# EAGLE design Grove - Triple Color E-Ink Display 2.13'' (EAGLE 9.1.2)

## Sheet 1 of 2
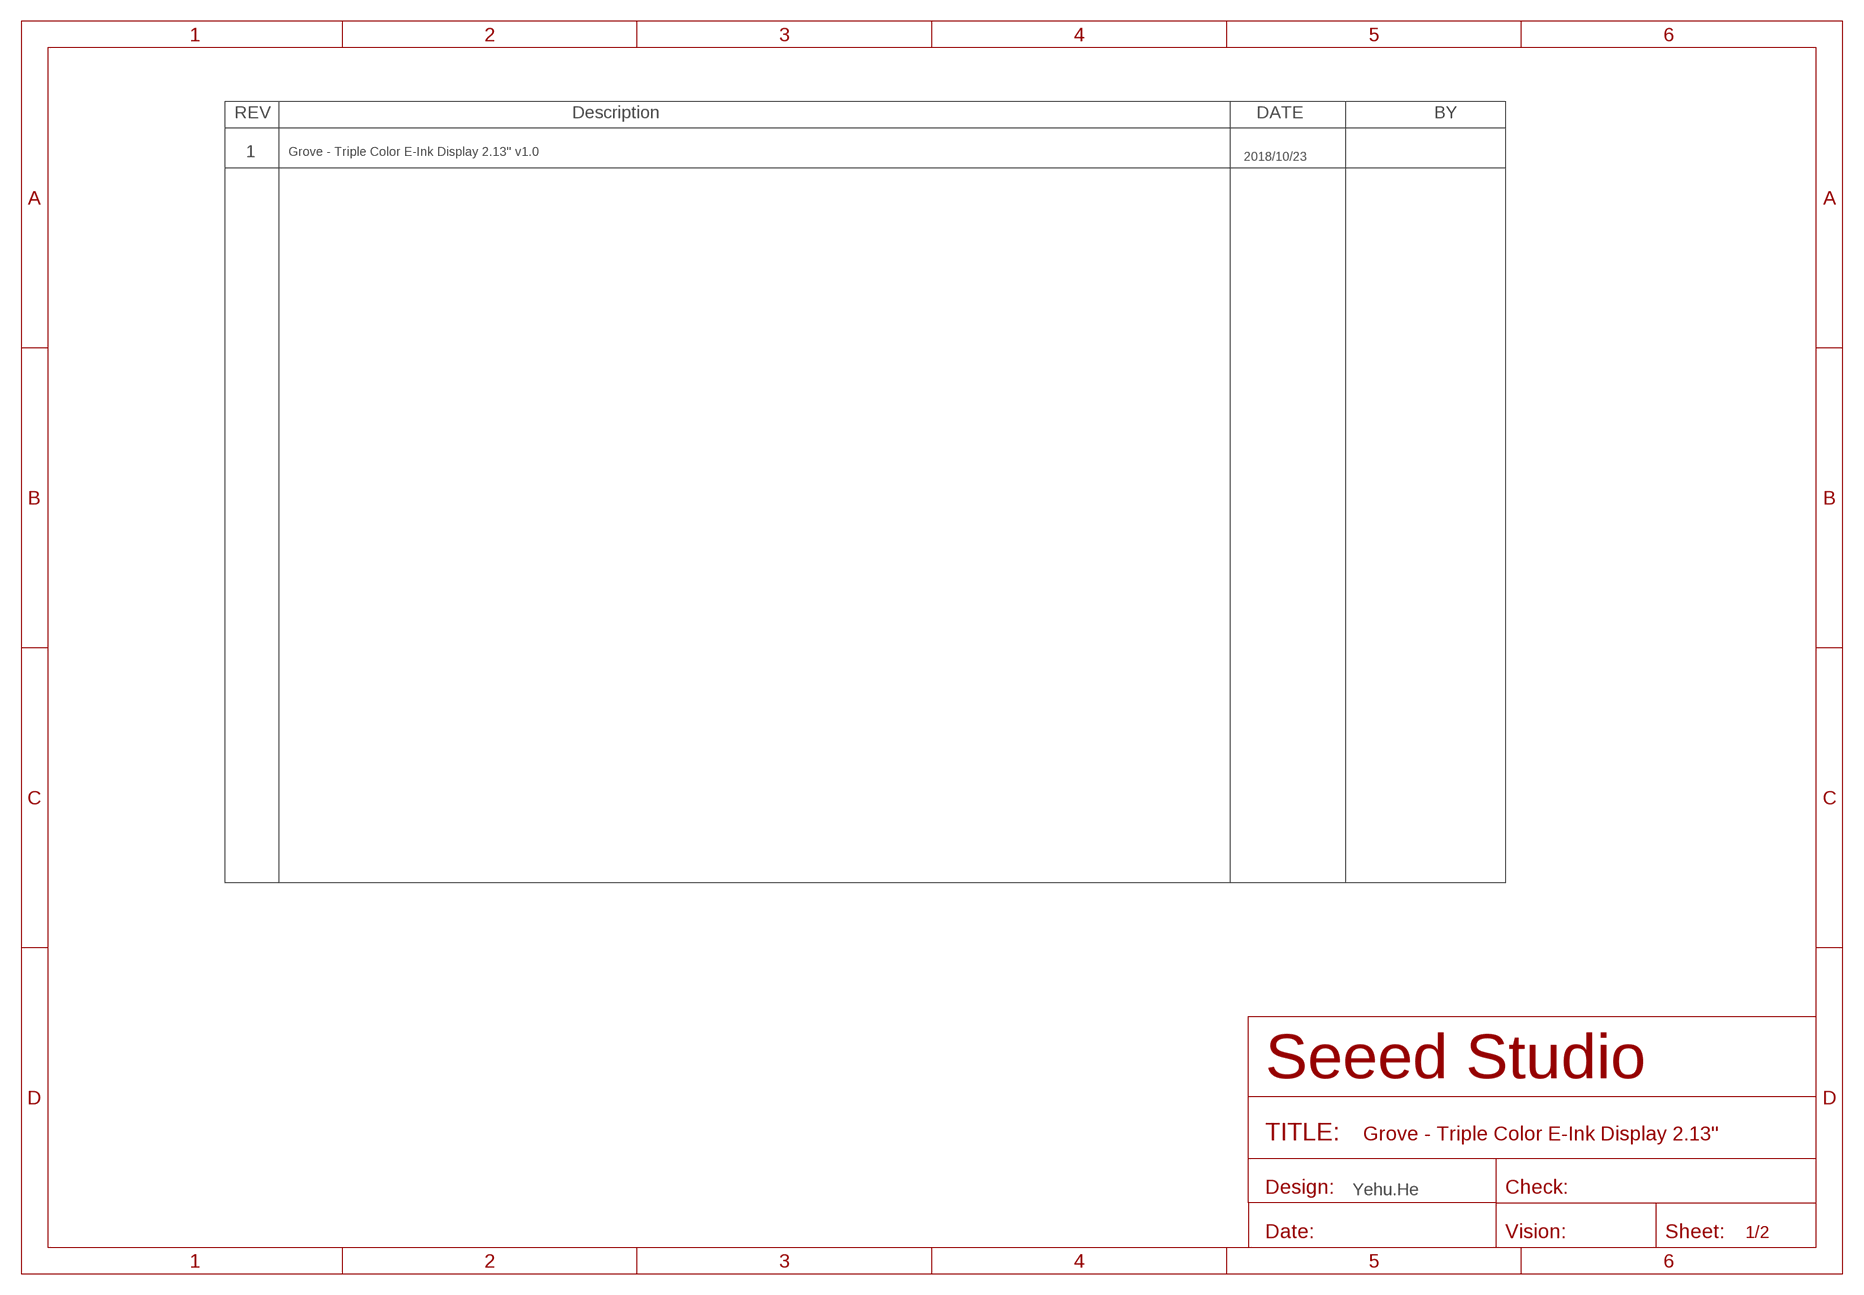
[diagram p0: schematic, sheet 1]

### Notes on the sheet
- 1 | Grove - Triple Color E-Ink Display 2.13'' v1.0
- 2018/10/23
- Yehu.He

## Sheet 2 of 2
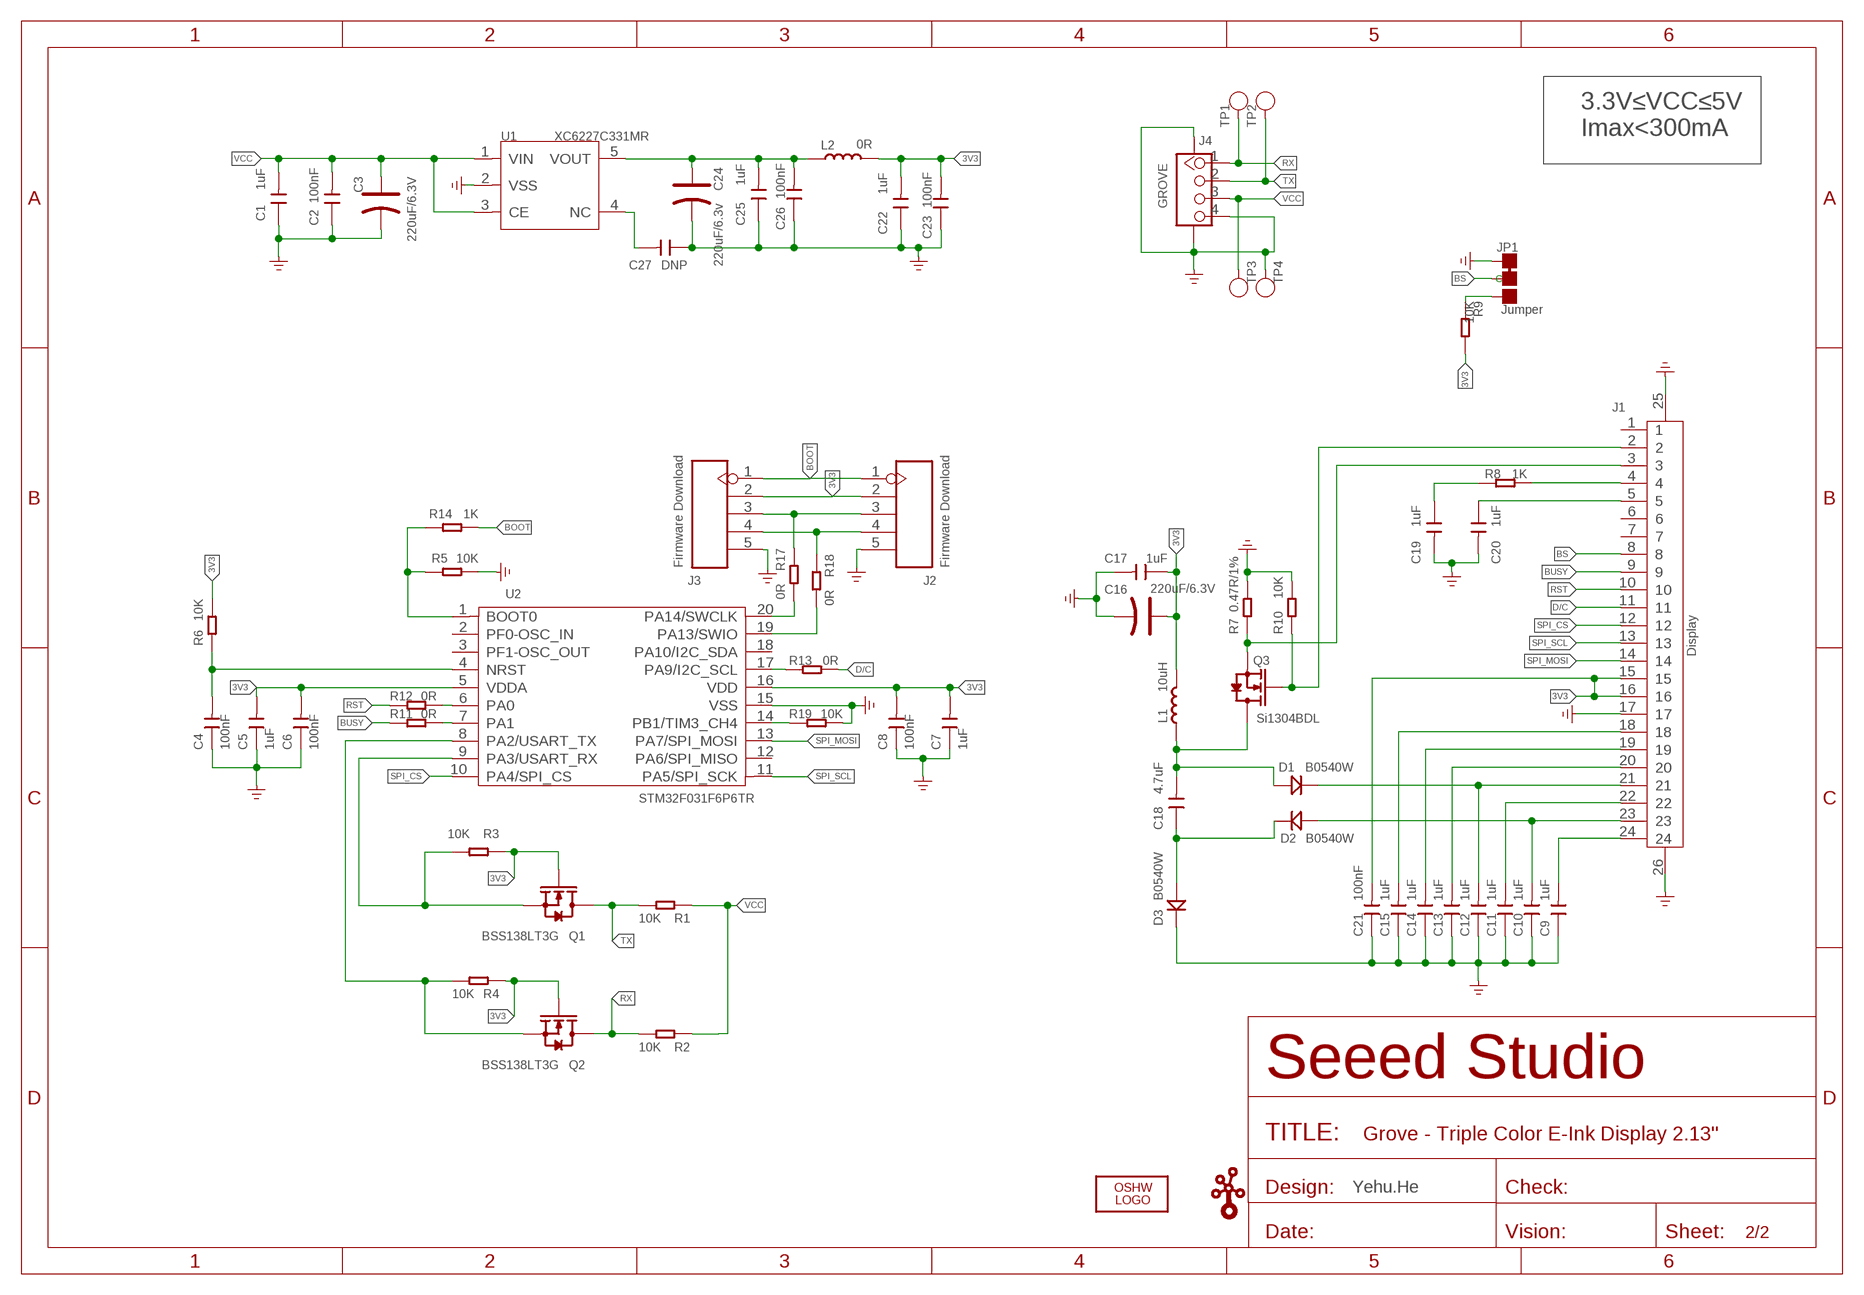
[diagram p1: schematic, sheet 2]

### Parts
C1  1uF  CAP-0603  [C0603]
C2  100nF  CAP-0603  [C0603]
C3  220uF/6.3V  CAP-POLAR-AVX-B  [AVX-B]
C4  100nF  CAP-0603  [C0603]
C5  1uF  CAP-0603  [C0603]
C6  100nF  CAP-0603  [C0603]
C7  1uF  CAP-0603  [C0603]
C8  100nF  CAP-0603  [C0603]
C9  1uF  CAP-0603  [C0603]
C10  1uF  CAP-0603  [C0603]
C11  1uF  CAP-0603  [C0603]
C12  1uF  CAP-0603  [C0603]
C13  1uF  CAP-0603  [C0603]
C14  1uF  CAP-0603  [C0603]
C15  1uF  CAP-0603  [C0603]
C16  220uF/6.3V  CAP-POLAR-AVX-B  [AVX-B]
C17  1uF  CAP-0603  [C0603]
C18  4.7uF  CAP-0805  [C0805]
C19  1uF  CAP-0603  [C0603]
C20  1uF  CAP-0603  [C0603]
C21  100nF  CAP-0603  [C0603]
C22  1uF  CAP-0805  [C0805]
C23  100nF  CAP-0603  [C0603]
C24  220uF/6.3v  CAP-POLAR-AVX-B  [AVX-B]
C25  1uF  CAP-0805  [C0805]
C26  100nF  CAP-0603  [C0603]
C27  DNP  CAP-0603  [C0603]
D1  B0540W  DIODE'0805'  [SOD-323]
D2  B0540W  DIODE'0805'  [SOD-323]
D3  B0540W  DIODE'0805'  [SOD-323]
J1  Display  FPC-CONNECTOR-24P  [FPCB24-SMD-0.5-17.6X5.0X2MM]
J2  Firmware Download  HEADER-5P-SMD2.54  [H5-SMD-2.54]
J3  Firmware Download  HEADER-5P-SMD2.54  [H5-SMD-2.54]
J4  GROVE  GROVE-CONNECTOR-SMD'90D'  [HW4-SMD-2.0-90D]
JP1  Jumper  JP-3P-SHORT  [3P-SMD-SHORT]
L1  10uH  INDUCTOR/FERRITE-BEAD5040S  [L5040S]
L2  0R  INDUCTOR/FERRITE-BEAD'0805'  [L0805]
LOGO2  LOGO-OSHW-FILLX0200-NT  [OSHW_FILLX200_NOTEXT]
Q1  BSS138LT3G  MOSFET-N'SI1304BDL'  [SOT-323]
Q2  BSS138LT3G  MOSFET-N'SI1304BDL'  [SOT-323]
Q3  Si1304BDL  MOSFET-N'SI1304BDL'  [SOT-323]
R1  10K  RES-0603  [R0603]
R2  10K  RES-0603  [R0603]
R3  10K  RES-0603  [R0603]
R4  10K  RES-0603  [R0603]
R5  10K  RES-0603  [R0603]
R6  10K  RES-0603  [R0603]
R7  0.47R/1%  RES-0603  [R0603]
R8  1K  RES-0603  [R0603]
R9  10K  RES-0603  [R0603]
R10  10K  RES-0603  [R0603]
R11  0R  RES-0603  [R0603]
R12  0R  RES-0603  [R0603]
R13  0R  RES-0603  [R0603]
R14  1K  RES-0603  [R0603]
R17  0R  RES-0603  [R0603]
R18  0R  RES-0603  [R0603]
R19  10K  RES-0603  [R0603]
TP1  Test  TEST-POINT'4545'  [TP-D45MIL]
TP2  Test  TEST-POINT'4545'  [TP-D45MIL]
TP3  Test  TEST-POINT'4545'  [TP-D45MIL]
TP4  Test  TEST-POINT'4545'  [TP-D45MIL]
U1  XC6227C331MR  PMIC-LDO-XC6210  [SOT-23-5]
U2  STM32F031F6P6TR  MCU-STM32F030  [TSSOP20-0.65-6.5X4.4MM]
U$20  LOGO-GROVE  [GROVE-SILK-BIG]

### Nets
3V3: C5.2 C6.2 C7.2 C8.2 C16.+ C17.1 C21.2 C22.2 C23.2 J1.15 J1.16 J2.2 J3.2 L1.2 L2.2 Q1.1(G) Q2.1(G) R3.2 R4.2 R6.1 R9.2 U2.5(VDDA) U2.16(VDD)
BOOT: J2.1 J3.1 R14.1
BS: J1.8 JP1.MM(C)
BUSY: J1.9 R11.1
D/C: J1.11 R13.1
GDR: J1.2 Q3.1(G) R10.1
GND: C1.1 C2.1 C3.- C4.1 C5.1 C6.1 C7.1 C8.1 C9.1 C10.1 C11.1 C12.1 C13.1 C14.1 C15.1 C16.- C17.2 C19.2 C20.2 C21.1 C22.1 C23.1 C24.- C25.1 C26.1 C27.1 D3.- J1.17 J1.25(P1) J1.26(P2) J2.5 J3.5 J4.4 J4.SS1 J4.SS2 JP1.11(L) R5.1 R7.2 R10.2 R19.1 TP4.T U1.2(VSS) U2.15(VSS) ; supply symbol labelled GND_POWER
N$1: R11.2 U2.7(PA1)
N$2: R12.2 U2.6(PA0)
N$3: R13.2 U2.17(PA9/I2C_SCL)
N$4: J2.3 J3.3 R17.1
N$5: R5.2 R14.2 U2.1(BOOT0)
N$6: R19.2 U2.14(PB1/TIM3_CH4)
N$7: C27.2 U1.4(NC)
N$8: C4.2 R6.2 U2.4(NRST)
N$9: C18.1 D2.- D3.+
N$10: J2.4 J3.4 R18.1
N$11: C18.2 D1.+ L1.1 Q3.3(D)
N$12: C19.1 R8.2
N$13: R17.2 U2.20(PA14/SWCLK)
N$14: R18.2 U2.19(PA13/SWIO)
N$22: C15.2 J1.18
N$23: C14.2 J1.19
N$24: C13.2 J1.20
N$25: C12.2 D1.- J1.21
N$26: C11.2 J1.22
N$27: C10.2 D2.+ J1.23
N$28: JP1.00(R) R9.1
RESE: J1.3 Q3.2(S) R7.1
RST: J1.10 R12.1
RX: J4.1 Q2.3(D) R2.1 TP1.T
SCL_3V3: Q1.2(S) R3.1 U2.9(PA3/USART_RX)
SDA_3V3: Q2.2(S) R4.1 U2.8(PA2/USART_TX)
SPI_CS: J1.12 U2.10(PA4/SPI_CS)
SPI_MOSI: J1.14 U2.13(PA7/SPI_MOSI)
SPI_SCL: J1.13 U2.11(PA5/SPI_SCK)
TX: J4.2 Q1.3(D) R1.1 TP2.T
VCC: C1.2 C2.2 C3.+ J4.3 R1.2 R2.2 TP3.T U1.1(VIN) U1.3(CE)
VCOM: C9.2 J1.24
VGH: C20.1 J1.5
VGL: J1.4 R8.1
VOUT: C24.+ C25.2 C26.2 L2.1 U1.5(VOUT)
Unconnected: J1.1 J1.6 J1.7 U2.2(PF0-OSC_IN) U2.3(PF1-OSC_OUT) U2.12(PA6/SPI_MISO) U2.18(PA10/I2C_SDA)

### Notes on the sheet
- 3.3V≤VCC≤5V
  Imax<300mA
- Yehu.He

## Library data of the parts
C1 C2 C4-C15 C17-C23 C25-C27 = Discrete-new:CAP: Ceramic Capacitors
C3 C16 C24 = Discrete-new:CAP-POLAR: Electrolytic Capacitors,Tantalum Capacitors and Super Capacitors
D1-D3 = Discrete-new:DIODE*
J1 = Connector-new:FPC-CONNECTOR-24P
J2 J3 = Connector-new:HEADER-5P
J4 = Connector-new:GROVE-CONNECTOR-SMD: 4P-SMD-2.0:320110030;4P-SMD-2.0-90D:320110032
JP1 = Discrete-new:JP-3P-SHORT
L1 L2 = Discrete-new:INDUCTOR/FERRITE-BEAD
LOGO2 = logo:LOGO-OSHW-FILL; PARTNO: DNP
Q1-Q3 = Discrete-new:MOSFET-N: IRLL014: http://www.vishay.com/docs/91319/sihll014.pdf
R1-R14 R17-R19 = Discrete-new:RES
TP1-TP4 = Discrete-new:TEST-POINT; PARTNO: DNP
U1 = IC-new:PMIC-LDO-XC6210
U2 = IC-new:MCU-STM32F030
U$20 = logo:LOGO-GROVE; PARTNO: DNP

## Board
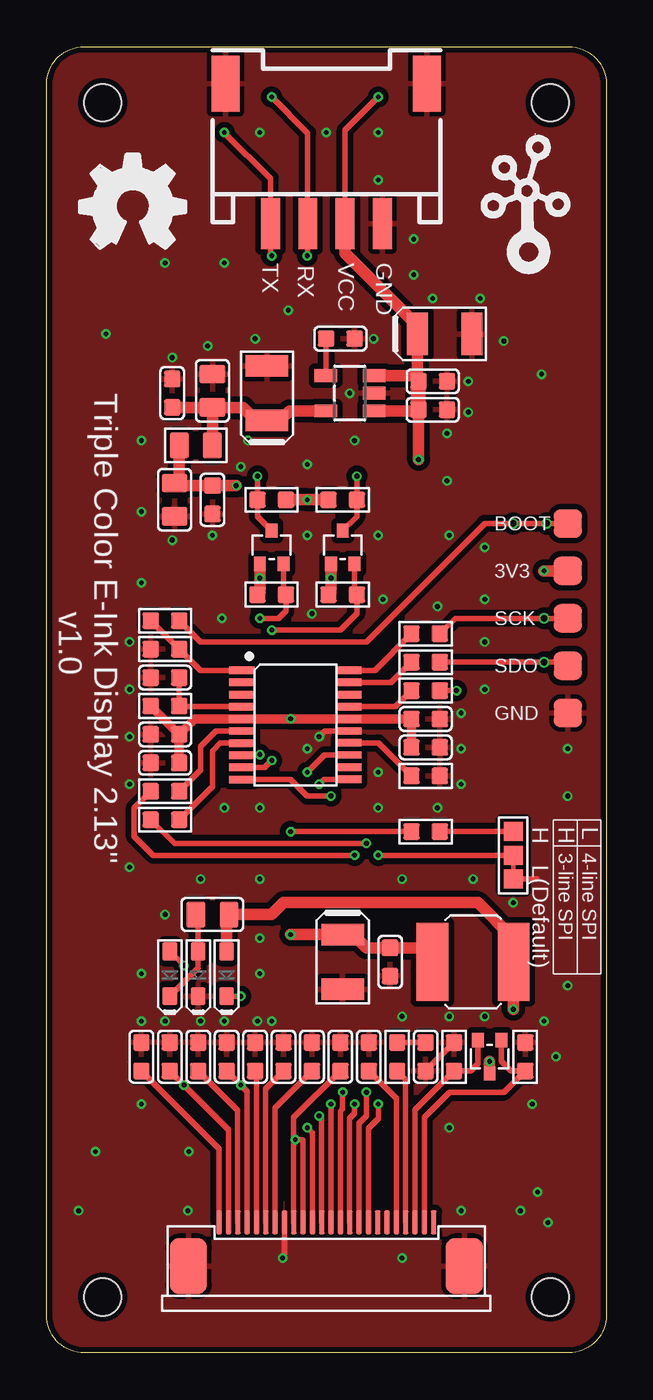
[diagram p2: board, top side]
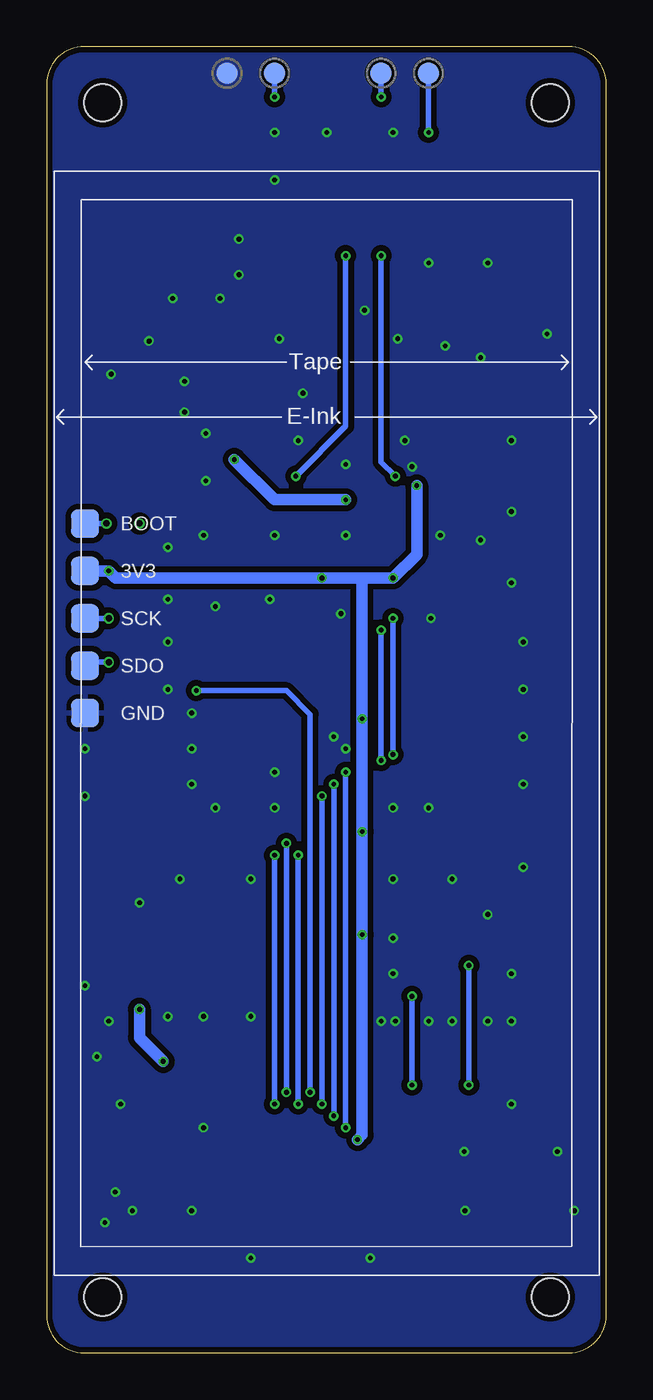
[diagram p3: board, bottom side, seen from below]

Size 30 x 70 mm. Coordinates in mm from the lower left corner, seen from the top.
Outline: 2,0 arc-90 0,2 0,68 arc-90 2,70 28,70 arc-90 30,68 30,2 arc-90 28,0 2,0
Copper layers (1*16): Top 0.035mm / dielectric 1.5mm / Bottom 0.035mm
Design rules "SeeedStudio_2layer_DRU_no_angle_20140221": minimum track width 1mil, minimum drill 10mil, track to track 6mil, track to pad 6mil, pad to pad 6mil, via to via 6mil, smd to smd 0mil, copper to edge 10mil, drill to drill 10mil, minimum pad ring 4mil, minimum via ring 4mil, stop-mask expansion 2mil, vias tented up to drill 25mil, thermal gap 10mil
Holes 2 mm at 3,67 27,67 27,3 3,3

### Footprints (pad centres in the part's own frame; a part is rotated, then mirrored left to right if it is on the bottom)
C0603 = smd 0.889 x 0.889: 1 -0.762,0; 2 0.762,0
AVX-B = smd 1.143 x 2.286: + 1.46,0; - -1.46,0
C0805 = smd 1.016 x 1.397: 1 -0.889,0; 2 0.889,0
SOD-323 = smd 1 x 0.8: + 1.2,0; - -1.2,0
FPCB24-SMD-0.5-17.6X5.0X2MM = smd 0.3 x 1.3: 1 5.75,0; 2 5.25,0; 3 4.75,0; 4 4.25,0; 5 3.75,0; 6 3.25,0; 7 2.75,0; 8 2.25,0; 9 1.75,0; 10 1.25,0; 11 0.75,0; 12 0.25,0; 13 -0.25,0; 14 -0.75,0; 15 -1.25,0; 16 -1.75,0; 17 -2.25,0; 18 -2.75,0; 19 -3.25,0; 20 -3.75,0; 21 -4.25,0; 22 -4.75,0; 23 -5.25,0; 24 -5.75,0 | smd 2 x 3: 25 -7.4,-2.35; 26 7.4,-2.35
H5-SMD-2.54 = smd 1.524 x 1.524: 1 0,5.08; 2 0,2.54; 3 0,0; 4 0,-2.54; 5 0,-5.08
HW4-SMD-2.0-90D = smd 1.01 x 2.74: 1 -3,-0.1; 2 -1,-0.1; 3 1,-0.1; 4 3,-0.1 | smd 1.5 x 3: SS1 -5.4,7.4; SS2 5.4,7.4
3P-SMD-SHORT = smd 1.016 x 1.016: 00 -1.27,0; 11 1.27,0; MM 0,0
L5040S = smd 1.7 x 4.2: 1 -2.175,0; 2 2.175,0
L0805 = smd 1.016 x 1.397: 1 -0.889,0; 2 0.889,0
SOT-323 = smd 0.762 x 0.635: 1 0.889,-0.635; 2 0.889,0.635; 3 -0.889,0
R0603 = smd 0.889 x 0.889: 1 -0.762,0; 2 0.762,0
TP-D45MIL = smd 1.143 x 1.143: T 0,0
SOT-23-5 = smd 0.69 x 1.2: 1 -0.95,-1.3; 2 0,-1.3; 3 0.95,-1.3; 4 0.95,1.3; 5 -0.95,1.3
TSSOP20-0.65-6.5X4.4MM = smd 0.4 x 1.35: 1 -2.925,-2.875; 2 -2.275,-2.875; 3 -1.625,-2.875; 4 -0.975,-2.875; 5 -0.325,-2.875; 6 0.325,-2.875; 7 0.975,-2.875; 8 1.625,-2.875; 9 2.275,-2.875; 10 2.925,-2.875; 11 2.91,2.875; 12 2.26,2.875; 13 1.61,2.875; 14 0.96,2.875; 15 0.325,2.875; 16 -0.325,2.875; 17 -0.975,2.875; 18 -1.625,2.875; 19 -2.275,2.875; 20 -2.925,2.875

### Placement (x,y rotation side)
C1  20.7,50.54 180 top
C2  20.7,52.07 180 top
C3  21.34,54.61 180 top
C4  6.35,36.19 0 top
C5  6.35,33.14 0 top
C6  6.35,31.62 0 top
C7  20.32,32.44 180 top
C8  20.32,33.97 180 top
C9  5.08,15.87 270 top
C10  6.6,15.87 270 top
C11  8.13,15.87 270 top
C12  9.65,15.87 270 top
C13  11.18,15.87 270 top
C14  12.7,15.87 270 top
C15  14.22,15.87 270 top
C16  15.87,20.95 90 top
C17  18.41,20.95 270 top
C18  8.89,23.49 0 top
C19  20.32,15.87 270 top
C20  17.27,15.87 90 top
C21  15.75,15.87 270 top
C22  6.86,45.72 90 top
C23  8.89,45.72 90 top
C24  11.81,51.43 270 top
C25  8.89,51.56 270 top
C26  6.73,51.43 270 top
C27  15.75,54.35 180 top
D1  9.65,20.32 90 top
D2  6.6,20.32 90 top
D3  8.13,20.32 90 top
J1  15,7 0 top
J2  27.94,39.37 0 top
J3  27.94,39.37 0 bottom
J4  15,60.6 0 top
JP1  25.02,26.67 270 top
L1  22.86,20.95 180 top
L2  8,48.64 180 top
LOGO2  1.78,59.18 0 top
Q1  15.87,43.18 270 top
Q2  12.06,43.18 270 top
Q3  23.75,15.87 90 top
R1  15.87,45.72 180 top
R2  12.06,45.72 0 top
R3  15.87,40.64 180 top
R4  12.06,40.64 180 top
R5  6.35,37.71 0 top
R6  6.35,34.67 0 top
R7  21.84,15.87 90 top
R8  18.8,15.87 90 top
R9  20.32,27.94 180 top
R10  25.65,15.87 90 top
R11  6.35,28.57 0 top
R12  6.35,30.09 0 top
R13  20.32,35.49 180 top
R14  6.35,39.24 180 top
R17  20.32,38.54 180 top
R18  20.32,37.02 180 top
R19  20.32,30.92 180 top
TP1  9.52,68.58 0 bottom
TP2  12.06,68.58 0 bottom
TP3  17.78,68.58 0 bottom
TP4  20.32,68.58 0 bottom
U1  16.26,51.43 90 top
U2  13.33,33.65 270 top
U$20  25.78,58.8 0 top

### Tracks (layer width: path | path; a pad name or v marks a point on that pad's centre or on a via)
3V3  (via drill 0.25 pad 0.51)
  Top 0.305: J1.16 13.25,11.43 | 13.25,11.43 13.25,12.61 C21.2 | J1.15 13.75,11.39 13.72,11.43 v13.33,11.43 13.25,11.43 | R9.2 v13.08,27.94
  Top 0.508: C7.2 C8.2 U2.16 v13.08,33.98 U2.5 7.94,33.98 C5.2 | C6.2 C5.2 | R6.1 C5.2
  Top 0.61: v13.08,22.41 C16.+ 15.94,22.35 16.51,22.35 17.14,21.71 C17.1 20.57,21.71 20.7,21.59 20.7,20.97 L1.2 | Q2.1 v11.43,41.52 11.43,40.76 R4.2 | J3.2 v26.67,41.91 | Q1.1 v15.24,41.52 15.24,40.76 R3.2 | 6.98,46.48 C23.2 v10.16,46.48 | 6.98,46.48 C22.2 | 6.98,46.48 6.86,46.48 | L2.2 7.11,46.6 6.98,46.48
  Bottom 0.61: v13.33,11.43 13.08,11.68 v13.08,22.41 v13.08,27.94 v13.08,33.98 13.08,41.52 | 13.08,41.52 v11.43,41.52 10.16,42.79 v10.16,46.48 | 13.08,41.52 v15.24,41.52 26.29,41.52 v26.67,41.91 J3.2
BOOT  (via drill 0.35)
  Top 0.305: R14.1 8.25,38.1 17.14,38.1 23.49,44.45 v25.02,44.45 | J3.1 v26.8,44.45 v25.02,44.45 | v25.02,44.45
  Bottom 0.305: v26.8,44.45 J3.1
BS  (via drill 0.25 pad 0.51)
  Top 0.305: J1.8 17.25,12.04 17.78,12.57 v17.78,13.33 | v17.78,26.67 JP1.MM
  Bottom 0.305: v17.78,13.33 v17.78,26.67
BUSY  (via drill 0.25 pad 0.51)
  Top 0.305: J1.9 16.75,12.3 17.14,12.7 v17.14,13.97 | v17.14,27.3 6.86,27.3 R11.1
  Bottom 0.305: v17.14,13.97 v17.14,27.3
D/C  (via drill 0.25 pad 0.51)
  Top 0.305: J1.11 15.75,12.95 15.87,13.08 v15.87,13.97 | v21.97,35.49 R13.1
  Bottom 0.305: v15.87,13.97 15.87,34.22 17.14,35.49 v21.97,35.49
GDR
  Top 0.305: J1.2 20.25,12.63 21.59,13.97 24.51,13.97 R10.1 24.89,15.11 24.38,15.62 Q3.1
GND  (via drill 0.25 pad 0.51)
  Top 0.305: U2.15 14.91,33.33 v14.6,33.02 | C19.2 R7.2 | J1.17 12.75,5.3 | JP1.11 26.29,25.4
  other vias: 13.97,32.38 17.78,31.11 17.78,29.21 11.43,29.21 9.52,29.21 23.49,18.03 21.59,18.03 19.05,18.03 12.06,17.78 11.3,17.78 9.52,17.78 8.25,17.78 6.35,17.78 5.08,17.78 2.62,10.79 1.71,7.62 26.32,8.62 21.59,12.06 26.87,6.98 5.08,13.33 5.08,20.32 6.35,23.49 11.43,25.4 8.25,25.4 4.44,30.48 4.44,33.02 4.44,38.1 4.44,35.56 4.44,26.03 9.4,39.37 14.22,39.62 13.97,43.81 18.03,40.38 20.95,40 23.49,43.18 23.49,40.38 23.49,38.1 23.49,35.56 22.22,34.29 22.22,32.38 22.22,30.48 20.95,29.21 19.05,25.4 22.86,25.4 25.02,24.13 26.67,17.78 26.03,13.33 27.3,15.87 25.4,7.62 27.94,32.38 27.94,29.84 17.78,43.81 21.59,43.81 5.08,45.08 6.73,53.34 22.61,52.07 21.46,49.27 11.43,65.4 14.99,65.4 17.78,65.4 17.78,62.86 10.79,48.89 13.97,47.62 11.18,54.35 8.64,53.97 16.26,51.43 10.41,47.49 8.89,43.81 9.52,58.42 6.35,58.42 19.68,59.69 24.51,54.22 22.61,50.41 27.94,19.68 11.43,22.22 11.43,20.32 12.95,55.88 21.46,46.73 26.54,52.45 12.65,5.08 7.57,7.62 22.22,7.62 19.05,5.08 7.62,10.79 6.73,43.56 5.08,41.27 5.08,48.89 16.51,48.89 17.53,54.35 20.7,56.51 23.24,56.51 19.68,57.78 3.17,54.61
  pour Bottom (isolate 0.305): 0,69.85 30.48,69.85 30.48,0 0,0
  pour Top (isolate 0.305): 0,69.85 30.48,69.85 30.48,0 0,0
N$1
  Top 0.305: U2.7 9.31,32.68 8.89,32.25 8.89,30.35 R11.2
N$2
  Top 0.305: U2.6 9.07,33.33 8.25,32.51 8.25,31.24 R12.2
N$3
  Top 0.305: U2.17 18.69,34.63 R13.2
N$4  (via drill 0.35)
  Top 0.305: J3.3 v26.67,39.37 21.91,39.37 R17.1
  Bottom 0.305: v26.67,39.37 J3.3
N$5
  Top 0.305: U2.1 8.25,36.58 R5.2 R14.2
N$6
  Top 0.305: U2.14 17.79,32.69 R19.2
N$7
  Top 0.305: C27.2 14.99,52.41 U1.4
N$8
  Top 0.305: U2.4 7.15,34.63 R6.2 C4.2
N$9
  Top 0.305: C18.1 8.13,23.36 D3.+ 8.13,20.64 D2.-
N$10  (via drill 0.35)
  Top 0.305: R18.1 v26.67,37.02 27.75,37.02 J3.4
  Bottom 0.305: v26.67,37.02 27.75,37.02 J3.4
N$11  (via drill 0.25 pad 0.51)
  Top 0.61: D1.+ 9.65,23.36 C18.2 12.06,23.49 12.7,24.13 23.11,24.13 25.03,22.2 L1.1 25.03,18.43 v25.02,18.41 | v23.75,15.62 Q3.3
  Bottom 0.61: v25.02,18.41 25.02,16.89 v23.75,15.62
N$12
  Top 0.305: C19.1 R8.2
N$13
  Top 0.305: U2.20 17.59,36.58 R17.2
N$14
  Top 0.305: U2.19 18.47,35.93 R18.2
N$22
  Top 0.305: J1.18 12.25,13.13 C15.2
N$23
  Top 0.305: J1.19 11.75,14.16 C14.2
N$24
  Top 0.305: J1.20 11.25,15.03 C13.2
N$25  (via drill 0.25 pad 0.51)
  Top 0.305: J1.21 10.75,14.01 v10.41,14.35 C12.2 | v10.41,19.11 D1.-
  Bottom 0.305: v10.41,14.35 v10.41,19.11
N$26
  Top 0.305: J1.22 10.25,12.99 C11.2
N$27  (via drill 0.25 pad 0.51)
  Top 0.305: J1.23 9.75,11.96 v7.37,14.35 C10.2 | v7.37,20.76 v7.36,20.76 D2.+
  Bottom 0.305: v7.37,14.35 v7.37,20.76
N$28
  Top 0.305: JP1.00 R9.1
RESE
  Top 0.305: J1.3 19.75,13.01 R7.1 22.73,15.11 23.11,15.49 Q3.2
RST  (via drill 0.25 pad 0.51)
  Top 0.305: J1.10 16.25,12.56 16.51,12.82 v16.51,13.33 | v16.51,26.67 5.71,26.67 4.7,27.68 4.7,29.21 R12.1
  Bottom 0.305: v16.51,13.33 v16.51,26.67
RX  (via drill 0.25 pad 0.51)
  Top 0.305: v9.52,65.4 12,62.93 J4.1 12,58.73 v12.06,58.8 | Q2.3 11.3,44.83 R2.1 v11.3,46.99
  Bottom 0.305: v9.52,65.4 TP1.T | v12.06,58.8 12.06,47.75 v11.3,46.99
SCL_3V3  (via drill 0.25 pad 0.51)
  Top 0.305: Q1.2 16.51,40.76 R3.1 16.64,39.62 15.75,38.73 v12.06,38.73 | U2.9 11.69,31.38 v12.06,31.75
  Bottom 0.305: v12.06,31.75 v12.06,38.73
SDA_3V3  (via drill 0.25 pad 0.51)
  Top 0.305: Q2.2 12.7,40.76 R4.1 12.83,39.75 12.45,39.37 v11.43,39.37 | U2.8 11.39,32.03 v11.43,32.06
  Bottom 0.305: v11.43,32.06 v11.43,39.37
SPI_CS  (via drill 0.25 pad 0.51)
  Top 0.305: J1.12 15.25,13.32 v15.24,13.33 | U2.10 13.08,30.73 13.97,29.84 v15.24,29.84
  Bottom 0.305: v15.24,13.33 v15.24,29.84
SPI_MOSI  (via drill 0.25 pad 0.51)
  Top 0.305: J1.14 14.25,11.78 v13.97,12.06 | U2.13 14.9,32.04 v13.97,31.11
  Bottom 0.305: v13.97,12.06 v13.97,31.11
SPI_SCL  (via drill 0.25 pad 0.51)
  Top 0.305: J1.13 14.75,12.55 v14.6,12.7 | U2.11 14.87,30.74 v14.6,30.48
  Bottom 0.305: v14.6,12.7 v14.6,30.48
TX  (via drill 0.25 pad 0.51)
  Top 0.305: v12.06,67.31 14,65.37 J4.2 14,58.83 v13.97,58.8 | Q1.3 16.64,44.83 R1.1 v16.64,46.99
  Bottom 0.305: v12.06,67.31 TP2.T | v13.97,58.8 13.97,49.65 v16.64,46.99
VCC  (via drill 0.25 pad 0.51)
  Top 0.305: J4.3 16,60.57 16,65.53 v17.78,67.31
  Top 0.61: R2.2 v13.97,45.72 R1.2 | U1.3 19.62,52.38 C2.2 | U1.1 19.88,50.48 | 19.88,50.48 C1.2 | 16,60.57 16,58.93 19.87,55.05 | C3.+ 19.87,51.75 19.94,51.68 | v19.94,47.87 19.94,50.42 19.88,50.48
  Top 0.813: C3.+ 19.87,55.05 | C1.2 19.94,51.68 C2.2
  Bottom 0.305: v17.78,67.31 TP3.T
  Bottom 0.61: v19.94,47.87 17.78,45.72 v13.97,45.72
VCOM
  Top 0.305: J1.24 9.25,10.94 C9.2
VGH
  Top 0.305: J1.5 18.75,13.63 C20.1
VGL
  Top 0.305: J1.4 19.25,14.65 R8.1
VOUT
  Top 0.61: C25.2 C26.2 6.86,50.67 | U1.5 13.02,50.48 12.57,50.03 11.43,50.03 11.3,49.91 | 11.3,49.91 11.75,49.91 C24.+ | C25.2 10.54,50.67 11.3,49.91 | C25.2 L2.1

### Text on the board
bPlace: Tape | E-Ink
tNames: TX | RX | VCC | GND | Triple Color E-Ink Display 2.13'' / v1.0 | BOOT | 3V3 | SCK | SDO | GND | H | H | L | 3-line SPI | 4-line SPI | L(Default)
bNames: BOOT | 3V3 | SCK | SDO | GND